# EAGLE design Group_02 (EAGLE 9.6.2)
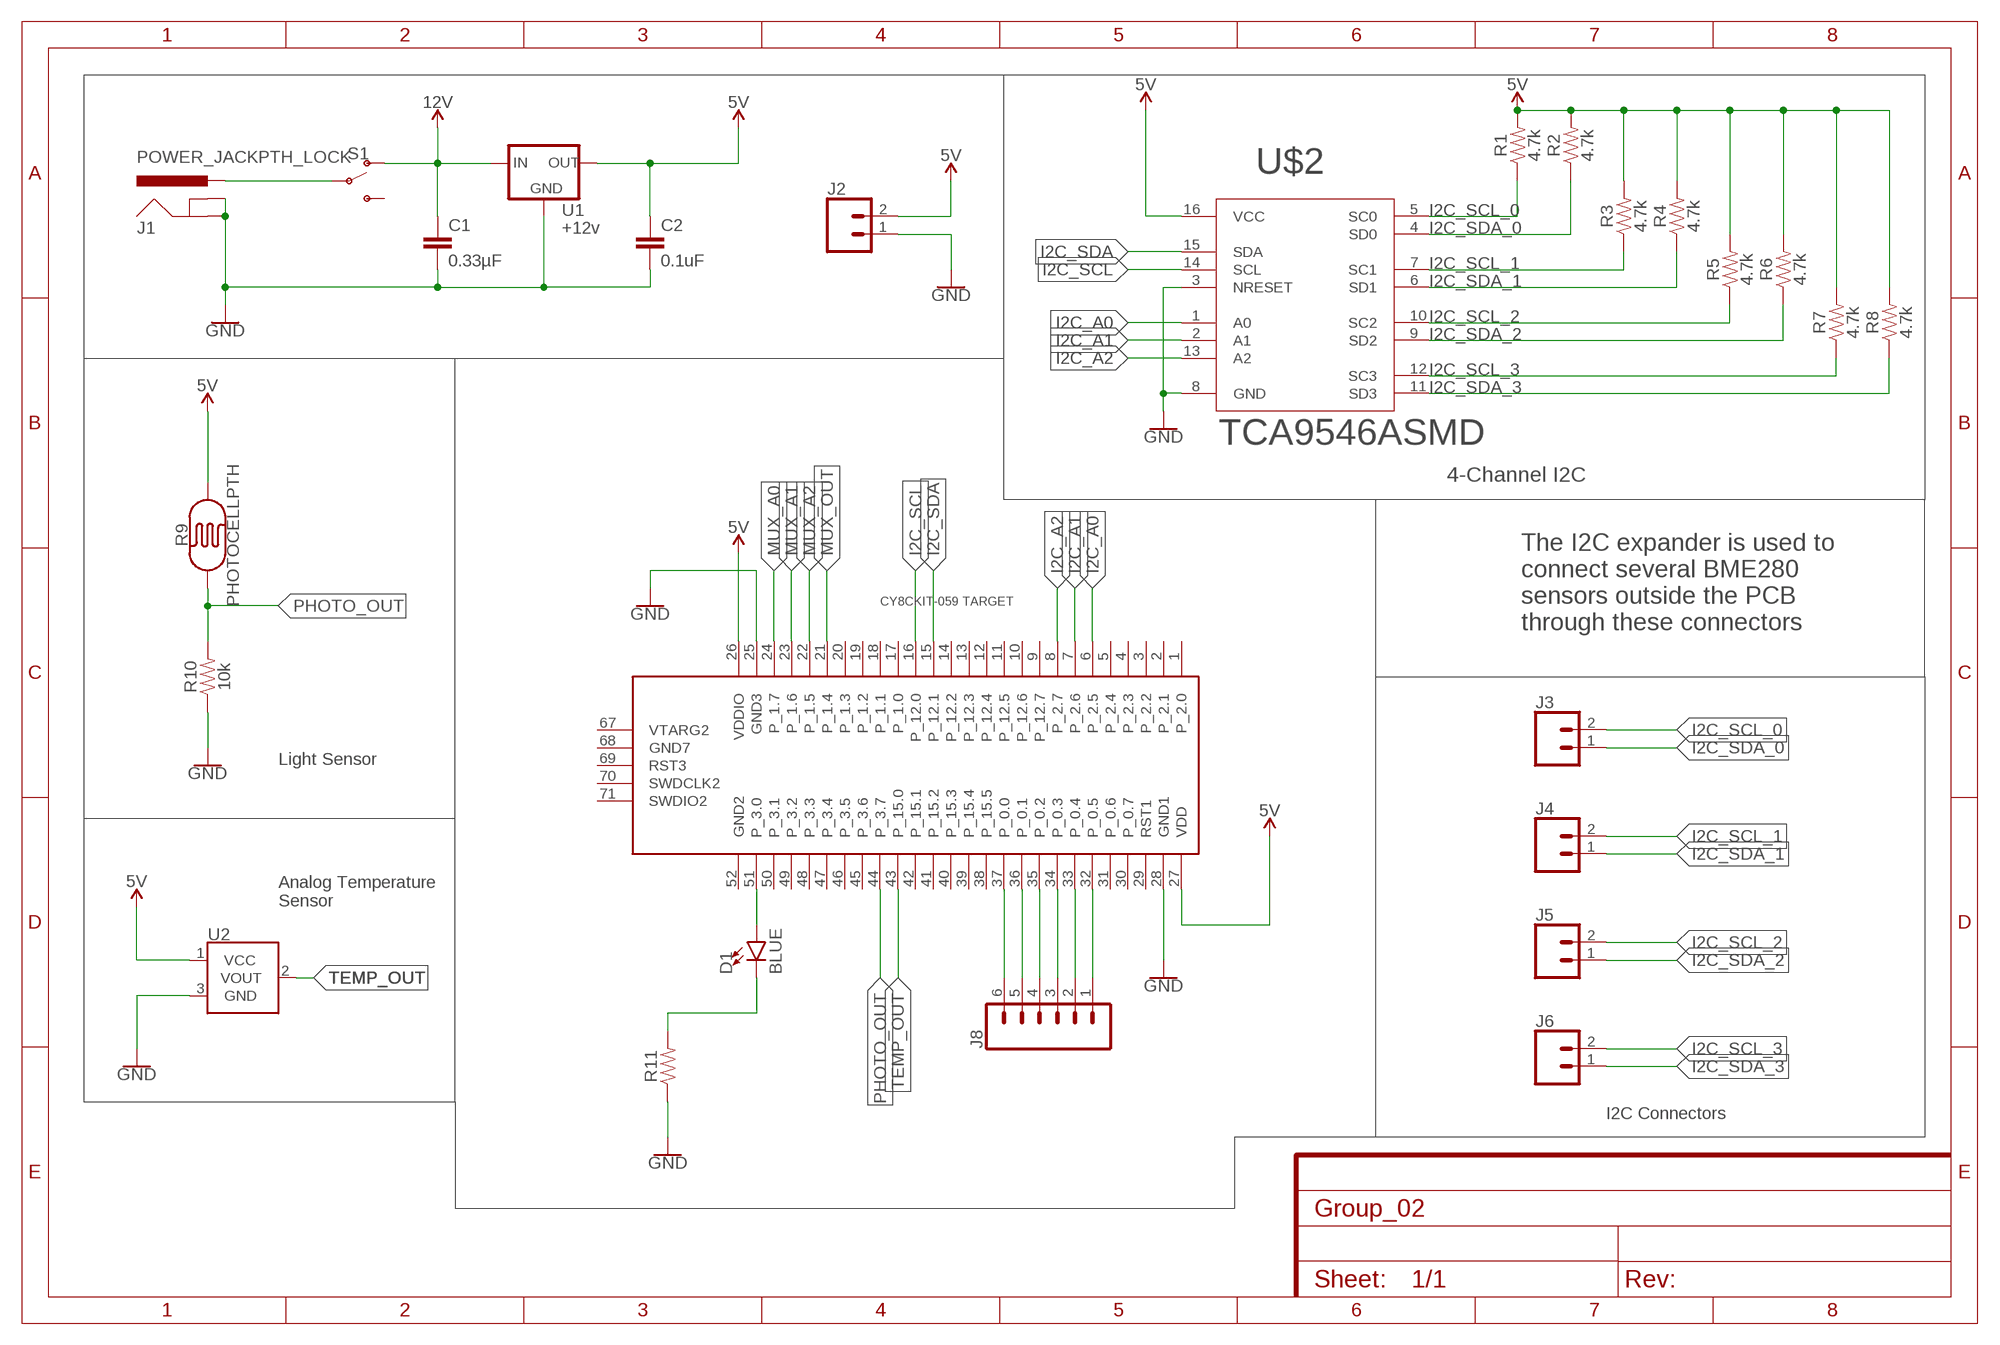
[diagram p0: schematic, sheet 1, part 1 of 2]
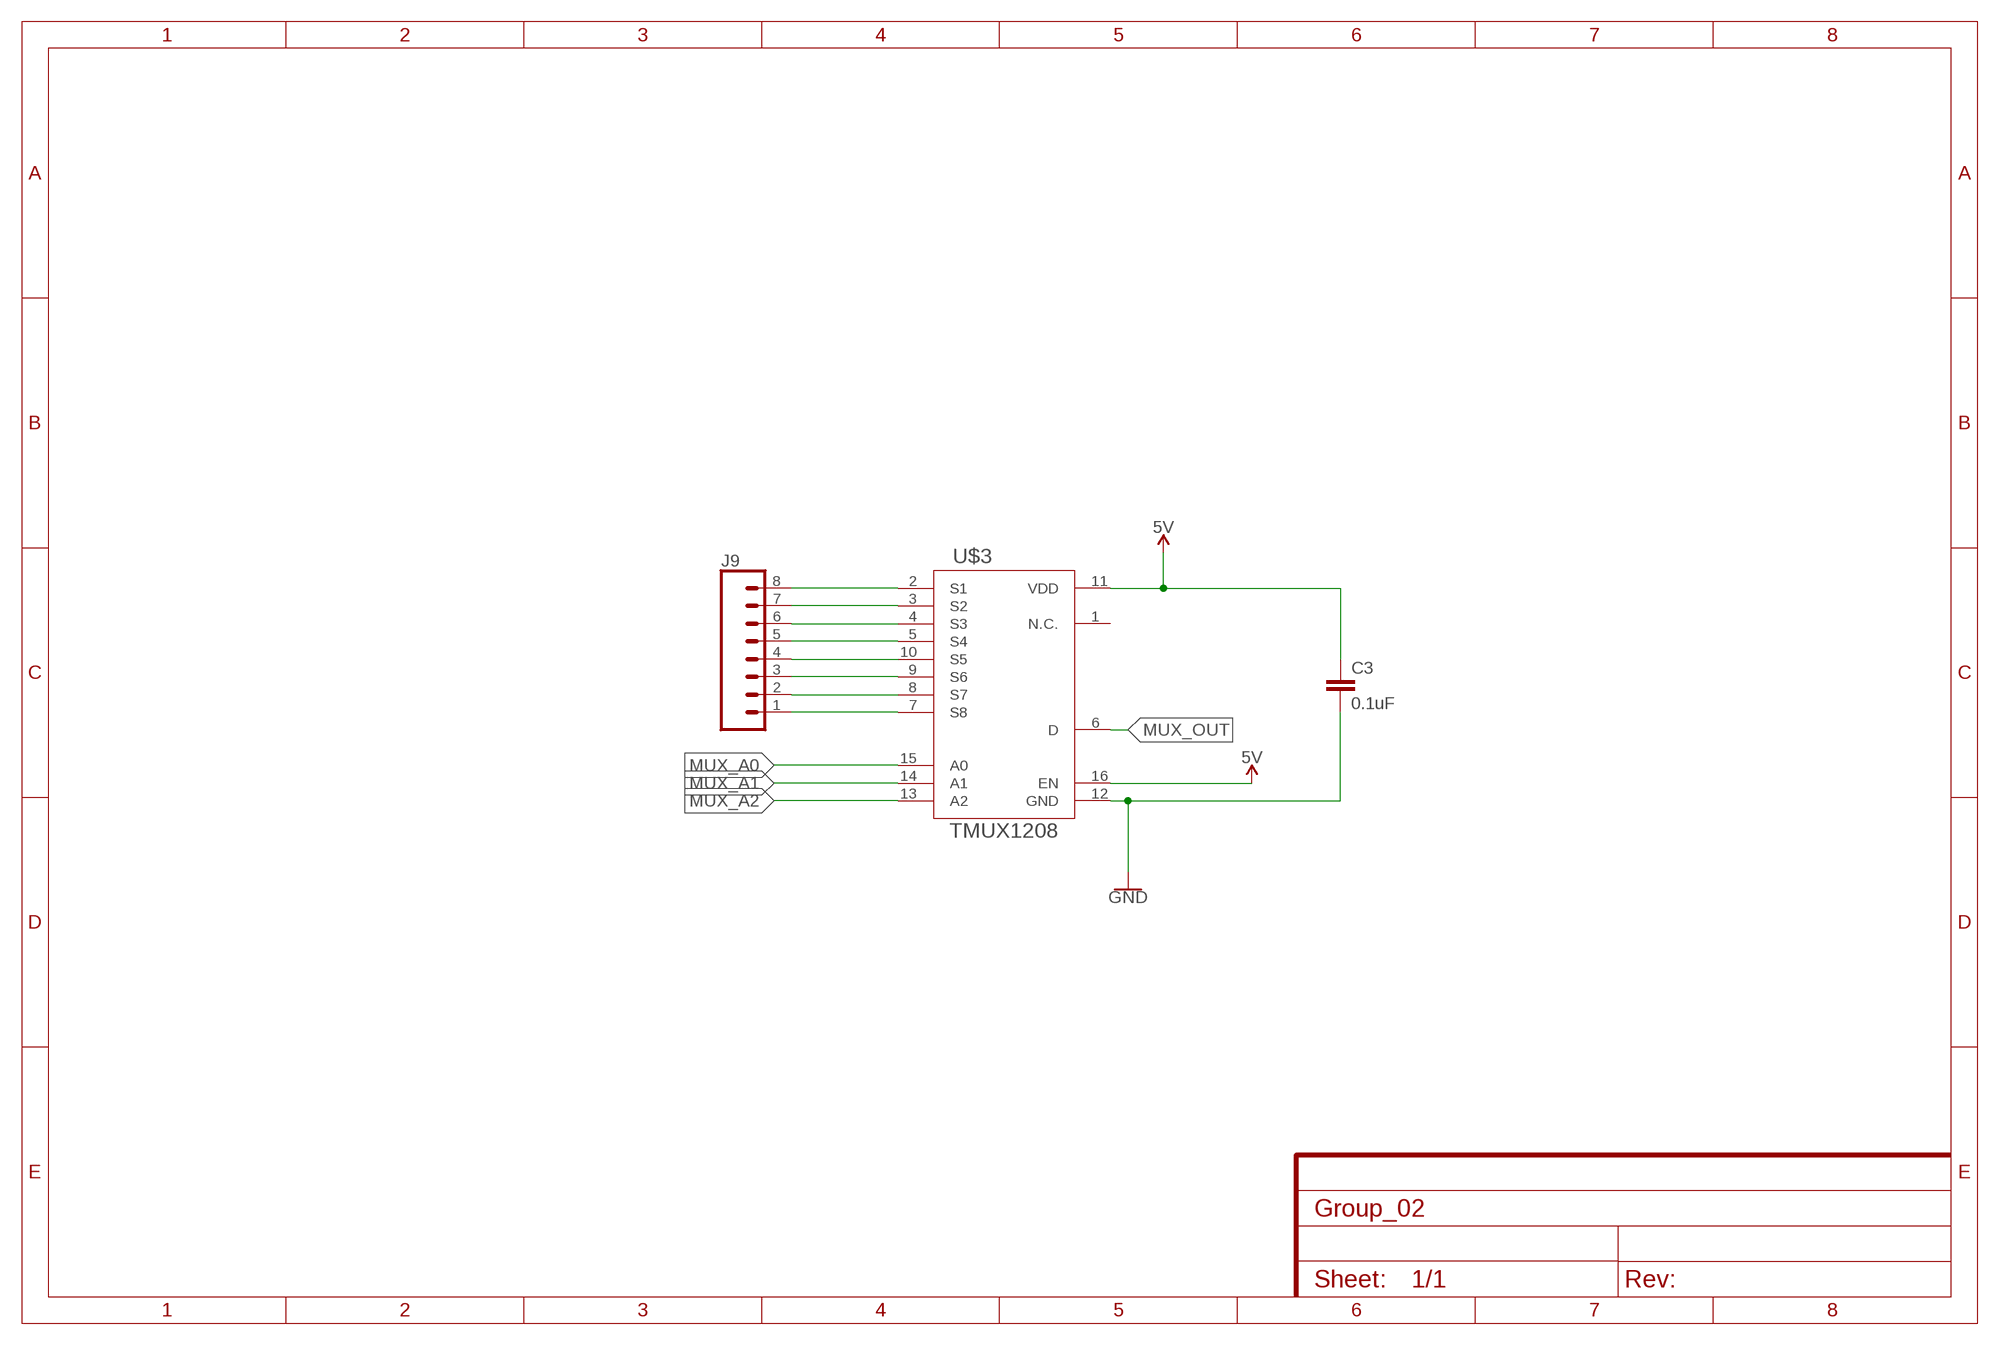
[diagram p1: schematic, sheet 1, part 2 of 2]

## Parts
C1  0.33µF  0.33UF/330NF-0805-50V-10%  [0805]
C2  0.1uF  0.1UF-KIT-EZ-50V-20%  [CAP-PTH-SMALL-KIT]
C3  0.1uF  0.1UF-KIT-EZ-50V-20%  [CAP-PTH-SMALL-KIT]
D1  BLUE  LED-BLUE1206  [LED-1206]
J1  POWER_JACKPTH_LOCK  [POWER_JACK_PTH_LOCK]
J2  CONN_02  [1X02]
J3  CONN_02  [1X02]
J4  CONN_02  [1X02]
J5  CONN_02  [1X02]
J6  CONN_02  [1X02]
J8  CONN_06LOCK  [1X06_LOCK]
J9  CONN_08LOCK  [1X08_LOCK]
R1  4.7k  4.7KOHM-0603-1/10W-1%  [0603]
R2  4.7k  4.7KOHM-0603-1/10W-1%  [0603]
R3  4.7k  4.7KOHM-0603-1/10W-1%  [0603]
R4  4.7k  4.7KOHM-0603-1/10W-1%  [0603]
R5  4.7k  4.7KOHM-0603-1/10W-1%  [0603]
R6  4.7k  4.7KOHM-0603-1/10W-1%  [0603]
R7  4.7k  4.7KOHM-0603-1/10W-1%  [0603]
R8  4.7k  4.7KOHM-0603-1/10W-1%  [0603]
R9  PHOTOCELLPTH  [PHOTOCELL]
R10  10k  10KOHM-0603-1/10W-1%  [0603]
R11  RESISTORAXIAL-0.3  [AXIAL-0.3]
S1  SWITCH-SPDT-PTH-11.6X4.0MM  [SWITCH_SPDT_PTH_11.6X4.0MM]
U1  +12v  V_REG_78XX7812  [TO-252]
U2  TMP36GT9  [TO-92]
U$1  CY8CKIT-059_TARGET  [CY8CKIT-059_TARGET]
U$2  TCA9546ASMD  [TSSOP-16]
U$3  TMUX1208  [QFN-16]

## Nets
5V: C2.1 C3.1 J2.2 R1.2 R2.2 R3.2 R4.2 R5.2 R6.2 R7.2 R8.2 R9.2 U1.2(OUT) U2.1(VCC) U$1.26(VDDIO) U$1.27(VDD) U$2.16(VCC) U$3.11(VDD) U$3.16(EN)
12V: C1.1 S1.1(O) U1.1(IN)
GND: C1.2 C2.2 C3.2 J1.GND J1.GNDBREAK J2.1 R10.1 R11.P$1 U1.3(GND) U2.3(GND) U$1.25(GND3) U$1.28(GND1) U$2.3(NRESET) U$2.8(GND) U$3.12(GND)
I2C_A0: U$1.6(P_2.5) U$2.1(A0)
I2C_A1: U$1.7(P_2.6) U$2.2(A1)
I2C_A2: U$1.8(P_2.7) U$2.13(A2)
I2C_SCL: U$1.16(P_12.0) U$2.14(SCL)
I2C_SCL_0: J3.2 R1.1 U$2.5(SC0)
I2C_SCL_1: J4.2 R3.1 U$2.7(SC1)
I2C_SCL_2: J5.2 R5.1 U$2.10(SC2)
I2C_SCL_3: J6.2 R7.1 U$2.12(SC3)
I2C_SDA: U$1.15(P_12.1) U$2.15(SDA)
I2C_SDA_0: J3.1 R2.1 U$2.4(SD0)
I2C_SDA_1: J4.1 R4.1 U$2.6(SD1)
I2C_SDA_2: J5.1 R6.1 U$2.9(SD2)
I2C_SDA_3: J6.1 R8.1 U$2.11(SD3)
MUX_A0: U$1.24(P_1.7) U$3.15(A0)
MUX_A1: U$1.23(P_1.6) U$3.14(A1)
MUX_A2: U$1.22(P_1.5) U$3.13(A2)
MUX_OUT: U$1.21(P_1.4) U$3.6(D)
N$1: J1.PWR S1.2(P)
N$2: J8.1 U$1.32(P_0.5)
N$3: J8.2 U$1.33(P_0.4)
N$4: J8.3 U$1.34(P_0.3)
N$5: J8.4 U$1.35(P_0.2)
N$6: J8.5 U$1.36(P_0.1)
N$7: J8.6 U$1.37(P_0.0)
N$8: D1.A U$1.51(P_3.0)
N$9: D1.C R11.P$2
N$10: J9.8 U$3.2(S1)
N$11: J9.7 U$3.3(S2)
N$12: J9.6 U$3.4(S3)
N$13: J9.5 U$3.5(S4)
N$14: J9.4 U$3.10(S5)
N$15: J9.3 U$3.9(S6)
N$16: J9.2 U$3.8(S7)
N$17: J9.1 U$3.7(S8)
PHOTO_OUT: R9.1 R10.2 U$1.44(P_3.7)
TEMP_OUT [New Class]: U2.2(VOUT) U$1.43(P_15.0)
Unconnected: S1.3(S) U$1.1(P_2.0) U$1.2(P_2.1) U$1.3(P_2.2) U$1.4(P_2.3) U$1.5(P_2.4) U$1.9(P_12.7) U$1.10(P_12.6) U$1.11(P_12.5) U$1.12(P_12.4) U$1.13(P_12.3) U$1.14(P_12.2) U$1.17(P_1.0) U$1.18(P_1.1) U$1.19(P_1.2) U$1.20(P_1.3) U$1.29(RST1) U$1.30(P_0.7) U$1.31(P_0.6) U$1.38(P_15.5) U$1.39(P_15.4) U$1.40(P_15.3) U$1.41(P_15.2) U$1.42(P_15.1) U$1.45(P_3.6) U$1.46(P_3.5) U$1.47(P_3.4) U$1.48(P_3.3) U$1.49(P_3.2) U$1.50(P_3.1) U$1.52(GND2) U$1.67(VTARG2) U$1.68(GND7) U$1.69(RST3) U$1.70(SWDCLK2) U$1.71(SWDIO2) U$3.1(N.C.)

## Notes on the sheet
- 4-Channel I2C
- The I2C expander is used to
  connect several BME280 
  sensors outside the PCB 
  through these connectors
- Light Sensor
- Analog Temperature
  Sensor
- I2C Connectors

## Library data of the parts
C1 = SparkFun-Capacitors:0.33UF/330NF: 0.33µF/330nF ceramic capacitors A capacitor is a passive two-terminal electrical component used to store electrical energy temporarily in an electric field.; PROD_ID: CAP-08469
C2 C3 = SparkFun-Capacitors:0.1UF: 0.1µF ceramic capacitors A capacitor is a passive two-terminal electrical component used to store electrical energy temporarily in an electric field.; PROD_ID: CAP-08370
D1 = SparkFun-LED:LED-BLUE: Blue SMD LED Used in manufacturing of various products at SparkFun Packages: 0603 - SMD 0603 package [Product Link] <http://www.digikey.com/product-detail/en/SMLE12BC7TT86/511-1589-2-ND/1641808> 1206 - SMD1206 package [Product Link] <http://www.digikey.com/product-detail/en/lite-on-inc/LTST-C150TBKT/160-1643-1-ND/573584> SparkFun Products: ESP8266 Thing-Dev Board <https://www.sparkfun.com/products/13711> RedBoard <https://www.sparkfun.com/products/12757>; PROD_ID: DIO-09911
J1 = SparkFun-Connectors:POWER_JACK: Power Jack Connector This is the standard 5.5mm barrel jack for power. The PTH is the most common, proven, reliable, footprint. The Slot footprint only works if the mill layer is transmitted to the PCB fab house so be warned. Here are the connectors we sell at SparkFun: DC Barrel Power Jack/Connector <https://www.sparkfun.com/products/119> (PRT-00119) DC Barrel Power Jack/Connector (SMD) <https://www.sparkfun.com/products/12748> (PRT-12748) DC Barrel Jack Adapter - Breadboard Compatible <https://www.sparkfun.com/products/10811> (PRT-10811) It is used on this SparkFun product (and many, many others): SparkFun RedBoard - Programmed with Arduino <https://www.sparkfun.com/products/12757> (DEV-12757) Also, if you need a mating power supply or connector, please check these out: Wall Adapter Power Supply - 9VDC 650mA <https://www.sparkfun.com/products/298> (TOL-00298) DC Barrel Jack Adapter - Male <https://www.sparkfun.com/products/10287> (PRT-10287); PROD_ID: CONN-08197; SF_ID: PRT-00119
J2-J6 = SparkFun-Connectors:CONN_02: Multi connection point. Often used as Generic Header-pin footprint for 0.1 inch spaced/style header connections On any of the 0.1 inch spaced packages, you can populate with these: Break Away Headers - Straight <https://www.sparkfun.com/products/116> (PRT-00116) Break Away Male Headers - Right Angle <https://www.sparkfun.com/products/553> (PRT-00553) Female Headers <https://www.sparkfun.com/products/115> (PRT-00115) Break Away Headers - Machine Pin <https://www.sparkfun.com/products/117> (PRT-00117) Break Away Female Headers - Swiss Machine Pin <https://www.sparkfun.com/products/743> (PRT-00743) For SCREWTERMINALS and SPRING TERMINALS visit here: Screw Terimnals on SparkFun.com <https://www.sparkfun.com/search/results?term=Screw+Terminals> (5mm/3.5mm/2.54mm spacing) This device is also useful as a general connection point to wire up your design to another part of your project. Our various solder wires solder well into these plated through hole pads. Hook-Up Wire - Assortment (Stranded, 22 AWG) <https://www.sparkfun.com/products/11375> (PRT-11375) Hook-Up Wire - Assortment (Solid Core, 22 AWG) <https://www.sparkfun.com/products/11367> (PRT-11367) View the entire wire category on our website here <https://www.sparkfun.com/categories/141> Special notes: Molex polarized connector foot print use with: PRT-08233 with associated crimp pins and housings. 2.54_SCREWTERM for use with PRT-10571. 3.5mm Screw Terminal footprints for PRT-08084 5mm Screw Terminal footprints for use with PRT-08432
J8 = SparkFun-Connectors:CONN_06: Multi connection point. Often used as Generic Header-pin footprint for 0.1 inch spaced/style header connections On any of the 0.1 inch spaced packages, you can populate with these: Break Away Headers - Straight <https://www.sparkfun.com/products/116> (PRT-00116) Break Away Male Headers - Right Angle <https://www.sparkfun.com/products/553> (PRT-00553) Female Headers <https://www.sparkfun.com/products/115> (PRT-00115) Break Away Headers - Machine Pin <https://www.sparkfun.com/products/117> (PRT-00117) Break Away Female Headers - Swiss Machine Pin <https://www.sparkfun.com/products/743> (PRT-00743) Arduino Stackable Header - 6 Pin <https://www.sparkfun.com/products/9280> (PRT-09280) For SCREWTERMINALS and SPRING TERMINALS visit here: Screw Terimnals on SparkFun.com <https://www.sparkfun.com/search/results?term=Screw+Terminals> (5mm/3.5mm/2.54mm spacing) This device is also useful as a general connection point to wire up your design to another part of your project. Our various solder wires solder well into these plated through hole pads. Hook-Up Wire - Assortment (Stranded, 22 AWG) <https://www.sparkfun.com/products/11375> (PRT-11375) Hook-Up Wire - Assortment (Solid Core, 22 AWG) <https://www.sparkfun.com/products/11367> (PRT-11367) View the entire wire category on our website here <https://www.sparkfun.com/categories/141>
J9 = SparkFun-Connectors:CONN_08: Multi connection point. Often used as Generic Header-pin footprint for 0.1 inch spaced/style header connections On any of the 0.1 inch spaced packages, you can populate with these: Break Away Headers - Straight <https://www.sparkfun.com/products/116> (PRT-00116) Break Away Male Headers - Right Angle <https://www.sparkfun.com/products/553> (PRT-00553) Female Headers <https://www.sparkfun.com/products/115> (PRT-00115) Break Away Headers - Machine Pin <https://www.sparkfun.com/products/117> (PRT-00117) Break Away Female Headers - Swiss Machine Pin <https://www.sparkfun.com/products/743> (PRT-00743) Arduino Stackable Header - 8 Pin <https://www.sparkfun.com/products/9279> (PRT-09279) For SCREWTERMINALS and SPRING TERMINALS visit here: Screw Terimnals on SparkFun.com <https://www.sparkfun.com/search/results?term=Screw+Terminals> (5mm/3.5mm/2.54mm spacing) This device is also useful as a general connection point to wire up your design to another part of your project. Our various solder wires solder well into these plated through hole pads. Hook-Up Wire - Assortment (Stranded, 22 AWG) <https://www.sparkfun.com/products/11375> (PRT-11375) Hook-Up Wire - Assortment (Solid Core, 22 AWG) <https://www.sparkfun.com/products/11367> (PRT-11367) View the entire wire category on our website here <https://www.sparkfun.com/categories/141> Special notes: Molex polarized connector foot print use with SKU : PRT-08231 with associated crimp pins and housings. 1MM SMD Version SKU: PRT-10208 NOTES ON THE VARIANTS LOCK and LOCK_LONGPADS... This footprint was designed to help hold the alignment of a through-hole component (i.e. 6-pin header) while soldering it into place. You may notice that each hole has been shifted either up or down by 0.005 of an inch from it's more standard position (which is a perfectly straight line). This slight alteration caused the pins (the squares in the middle) to touch the edges of the holes. Because they are alternating, it causes a "brace" to hold the component in place. 0.005 has proven to be the perfect amount of "off-center" position when using our standard breakaway headers. Although looks a little odd when you look at the bare footprint, once you have a header in there, the alteration is very hard to notice. Also,if you push a header all the way into place, it is covered up entirely on the bottom side.
R1-R8 = SparkFun-Resistors:4.7KOHM: 4.7kΩ resistor A resistor is a passive two-terminal electrical component that implements electrical resistance as a circuit element. Resistors act to reduce current flow, and, at the same time, act to lower voltage levels within circuits. - Wikipedia; PROD_ID: RES-07857
R9 = SparkFun-Sensors:PHOTOCELL: Photocell (Photodetector, Photo Resistor, CdS) This is a very small light sensor. A photocell changes (also called a photodetector, photo resistor, CdS or photoconductive cell) resistance depending on the amount of light it is exposed to. These little sensors make great ambient light triggers (when light in the room turns on, do something). Datasheet <http://cdn.sparkfun.com/datasheets/Sensors/LightImaging/SEN-09088.pdf> SparkFun Products Mini Photocell <https://www.sparkfun.com/products/9088> (SEN-09088); PROD_ID: COMP-09129; SF_ID: SEN-09088
R10 = SparkFun-Resistors:10KOHM: 10kΩ resistor A resistor is a passive two-terminal electrical component that implements electrical resistance as a circuit element. Resistors act to reduce current flow, and, at the same time, act to lower voltage levels within circuits. - Wikipedia; PROD_ID: RES-00824
R11 = SparkFun-Resistors:RESISTOR: Generic Resistor Package
S1 = SparkFun-Switches:SWITCH-SPDT: Single Pole, Double Throw (SPDT) Switch Single-pole, double-throw (SPDT) switch. Variant Overview SMD-AYZ0202 Surface Mount DPDT Switch <https://www.sparkfun.com/products/597> (COM-00597) Used on e.g. LilyPad Arduino USB - ATmega32U4 Board <https://www.sparkfun.com/products/12049> PTH-11.6X4.0MM SPDT Mini Power Switch <https://www.sparkfun.com/products/102> (COM-00102) Used on e.g. SparkFun Simon Says - Through-Hole Soldering Kit <https://www.sparkfun.com/products/10547> (KIT-10547) PTH-11.6X4.0MM-KIT KIT version of SPDT Mini Power Switch - Simplifies soldering by removing tStop of switch pins - only one side can be soldered. PTH-11.6X4.0MM-LOCK LOCK version of SPDT Mini Power Switch - Offset pins hold switch in place for easier soldering. SMD-RIGHT-ANGLE Surface Mount Right Angle Switch <https://www.sparkfun.com/products/10860> (COM-10860) Used on e.g. SparkFun ESP8266 Thing <https://www.sparkfun.com/products/13231>; PROD_ID: SWCH-08261; SF_SKU: COM-00102
U1 = SparkFun-IC-Power:V_REG_78XX: Voltage Regulator Standard 78xx regulator. IGO (Input Ground Output). Spark Fun Electronics SKU : COM-00107; PROD_ID: VREG-12370
U2 = SparkFun-Sensors:TMP36: TMP36 Precision Analog °C Temperature Sensor The TMP36 is a low voltage, precision centigrade temperature sensor. It provides a voltage output that is linearly proportional to the Celsius temperature. It also doesn’t require any external calibration to provide typical accuracies of ±1°C at +25°C and ±2°C over the −40°C to +125°C temperature range. We like it because it’s so easy to use: Just give the device a ground and 2.7 to 5.5 VDC and read the voltage on the Vout pin. The output voltage can be converted to temperature easily using the scale factor of 10 mV/°C. Datasheet <http://cdn.sparkfun.com/datasheets/Sensors/Temp/TMP35_36_37.pdf> SparkFun Products Temperature Sensor - TMP36 <https://www.sparkfun.com/products/10988> (SEN-10988) SparkFun Danger Shield <https://www.sparkfun.com/products/11649> (DEV-11649); PROD_ID: IC-09880; SF_ID: SEN-10988
U$1 = CY8KIT-059:CY8CKIT-059_TARGET: CY8CKIT-059 Target This device exposes the pins of the target section of the CY8CKIT-059, including the programming section, that must be connected to the KitProg in order to program the target micro-controller.
U$2 = Group_02_Library:TCA9546A: TCA9546A The TCA9546A is a quad bidirectional translating switch controlled via the I^2C bus. The SCL/SDA upstream pair fans out to four downstream pairs, or channels. Any individual SCn/SDn channel or combination of channels can be selected, determined by the contents of the programmable control register. Available packages: TSSOP-16 SOIC-16
U$3 = Group_02_Library:TMUX1208: TMUX1208 The TMUX1208 and TMUX1209 are general purpose complementary metal-oxide semiconductor (CMOS) multiplexers (MUX). The TMUX1208 offers 8:1 singleended channels, while the TMUX1209 offers differential 4:1 or dual 4:1 single-ended channels. Wide operating supply of 1.08 V to 5.5 V allows for use in a broad array of applications from personal electronics to building automation applications. The device supports bidirectional analog and digital signals on the source (Sx) and drain (D) pins ranging from GND to VDD. Available packages: TSSOP-16 QFN-16

## Board
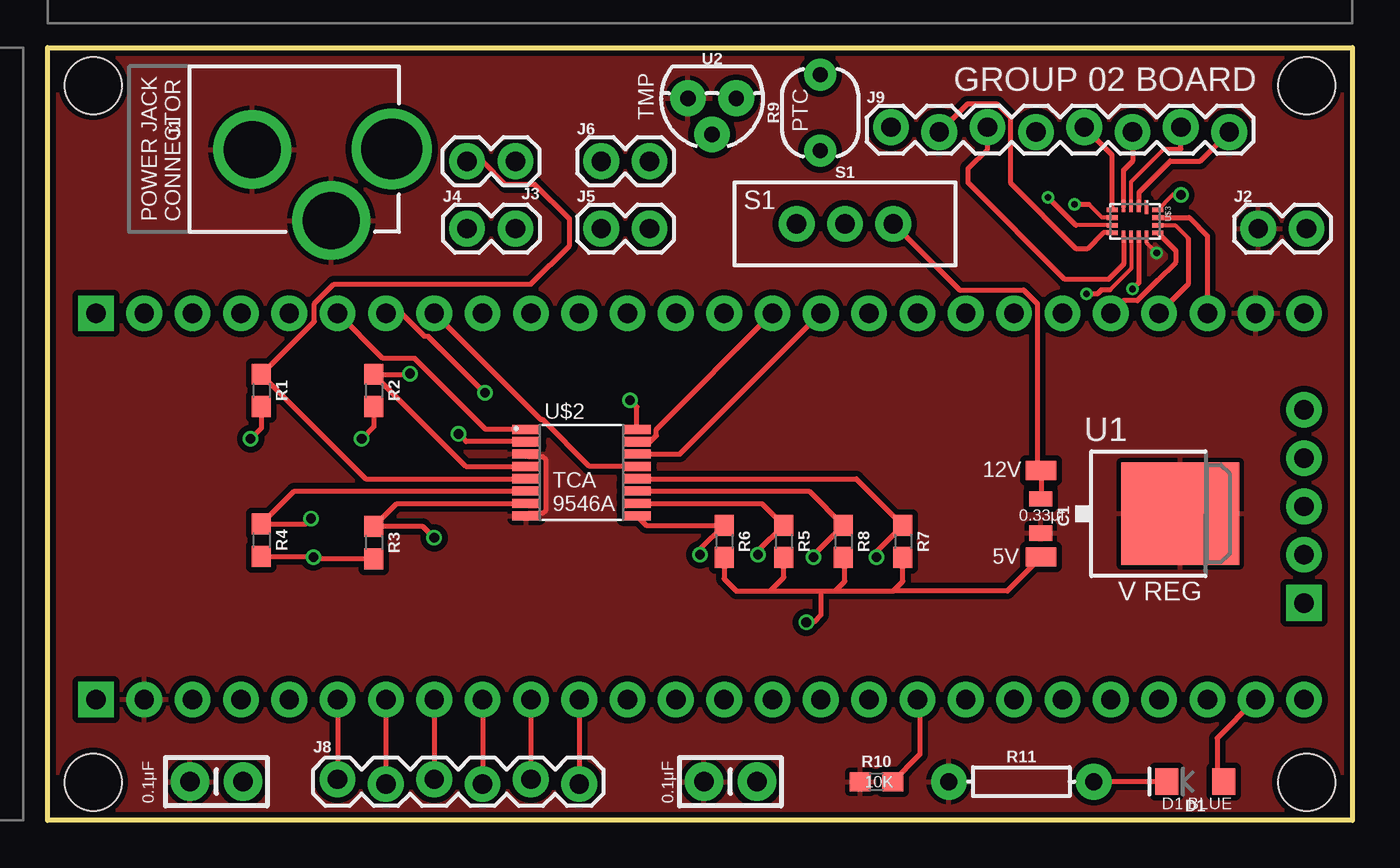
[diagram p2: board, top side]
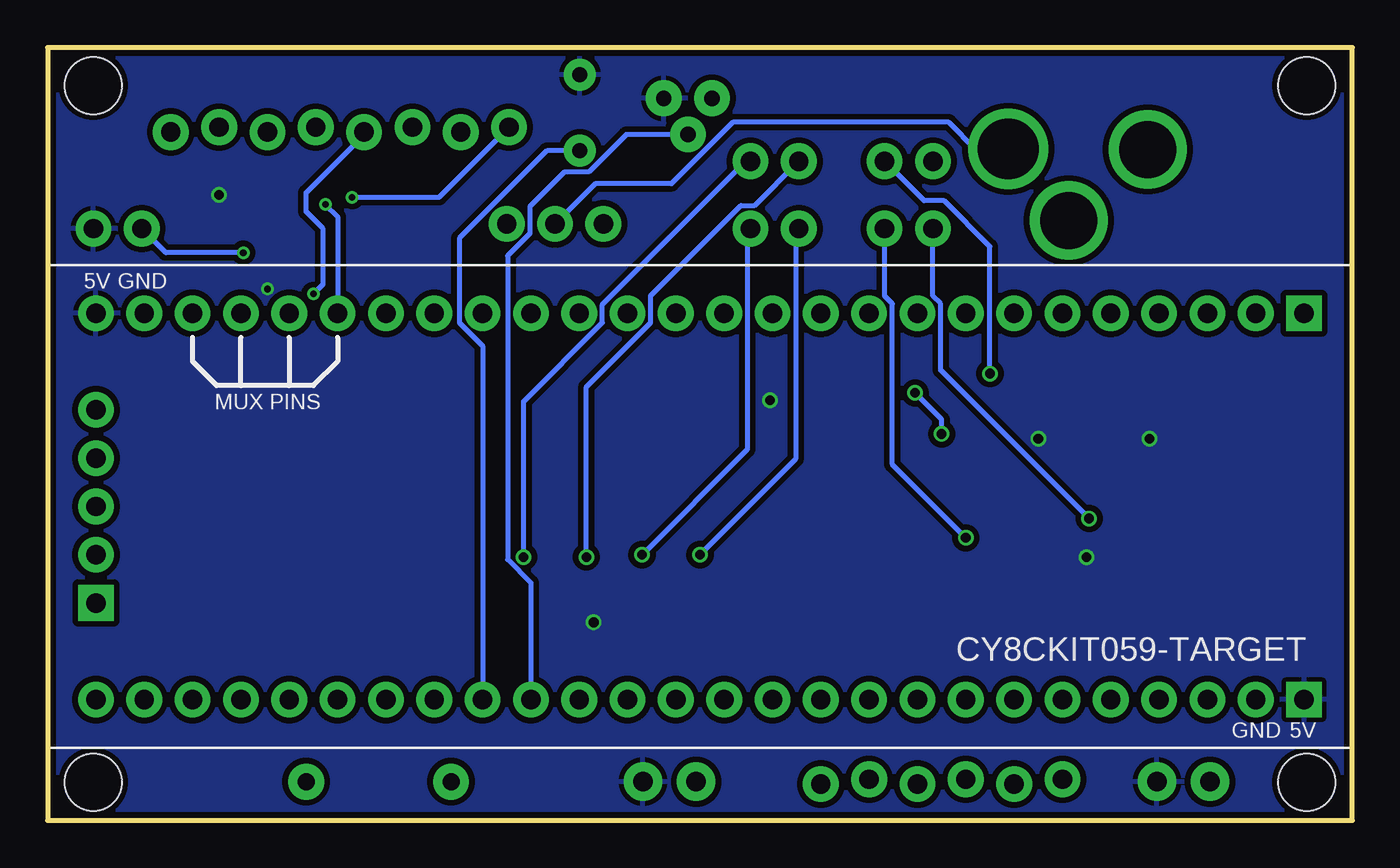
[diagram p3: board, bottom side, seen from below]

Size 68.58 x 40.64 mm. Coordinates in mm from the lower left corner, seen from the top.
Outline: 0,0 0,40.64 68.58,40.64 68.58,0 0,0
Copper layers (1*16): Top 0.035mm / dielectric 1.5mm / Bottom 0.035mm
Design rules "Group_02": minimum track width 6mil, minimum drill 8mil, track to track 6mil, track to pad 6mil, pad to pad 6mil, via to via 6mil, smd to smd 6mil, copper to edge 8mil, drill to drill 22mil, minimum pad ring 8mil, minimum via ring 6mil, stop-mask expansion 8mil, vias tented up to drill 0mil, thermal gap 10mil
Holes 3 mm at 2.4,2 66.18,2 66.18,38.64 2.4,38.64

### Footprints (pad centres in the part's own frame; a part is rotated, then mirrored left to right if it is on the bottom)
0805 = smd 0.8 x 1.2: 1 -0.9,0; 2 0.9,0
CAP-PTH-SMALL-KIT = drill 1.016 pad 2.032: 1 -1.397,0; 2 1.397,0
LED-1206 = smd 1.2 x 1.4: A -1.5,0; C 1.5,0
POWER_JACK_PTH_LOCK = drill 2.997 pad 4.115: GND 0.025,6.557; GNDBREAK 3.762,10.7 | drill 3.2 pad 4.115: PWR 0,13.878
1X02 = drill 1.016 pad 1.88: 1 0,0; 2 2.54,0
1X06_LOCK = drill 1.016 pad 1.88: 1 0,0; 2 2.54,-0.254; 3 5.08,0; 4 7.62,-0.254; 5 10.16,0; 6 12.7,-0.254
1X08_LOCK = drill 1.016 pad 1.88: 1 0,0.127; 2 2.54,-0.127; 3 5.08,0.127; 4 7.62,-0.127; 5 10.16,0.127; 6 12.7,-0.127; 7 15.24,0.127; 8 17.78,-0.127
0603 = smd 1.1 x 1: 1 -0.85,0; 2 0.85,0
PHOTOCELL = drill 0.8 pad 1.676: 1 -2,0; 2 2,0
AXIAL-0.3 = drill 0.9 pad 1.88: P$1 -3.81,0; P$2 3.81,0
SWITCH_SPDT_PTH_11.6X4.0MM = drill 1.016 pad 1.88: 1 0,2.54; 2 0,0; 3 0,-2.54
TO-252 = smd 1 x 1.6: 1 -2.28,-4.8; 2 2.28,-4.8 | smd 5.4 x 6.2: 3 0,2.5
TO-92 = drill 0.813 pad 1.88: 1 -1.27,0; 2 0,1.905; 3 1.27,0
CY8CKIT-059_TARGET = drill 1.016 pad 1.876 square: 1 30.48,8.89; 27 30.48,-11.43; 71 -33.02,-6.35 | drill 1.016 pad 1.876: 2 27.94,8.89; 3 25.4,8.89; 4 22.86,8.89; 5 20.32,8.89; 6 17.78,8.89; 7 15.24,8.89; 8 12.7,8.89; 9 10.16,8.89; 10 7.62,8.89; 11 5.08,8.89; 12 2.54,8.89; 13 0,8.89; 14 -2.54,8.89; 15 -5.08,8.89; 16 -7.62,8.89; 17 -10.16,8.89; 18 -12.7,8.89; 19 -15.24,8.89; 20 -17.78,8.89; 21 -20.32,8.89; 22 -22.86,8.89; 23 -25.4,8.89; 24 -27.94,8.89; 25 -30.48,8.89; 26 -33.02,8.89; 28 27.94,-11.43; 29 25.4,-11.43; 30 22.86,-11.43; 31 20.32,-11.43; 32 17.78,-11.43; 33 15.24,-11.43; 34 12.7,-11.43; 35 10.16,-11.43; 36 7.62,-11.43; 37 5.08,-11.43; 38 2.54,-11.43; 39 0,-11.43; 40 -2.54,-11.43; 41 -5.08,-11.43; 42 -7.62,-11.43; 43 -10.16,-11.43; 44 -12.7,-11.43; 45 -15.24,-11.43; 46 -17.78,-11.43; 47 -20.32,-11.43; 48 -22.86,-11.43; 49 -25.4,-11.43; 50 -27.94,-11.43; 51 -30.48,-11.43; 52 -33.02,-11.43; 67 -33.02,3.81; 68 -33.02,1.27; 69 -33.02,-1.27; 70 -33.02,-3.81
TSSOP-16 = smd 1.5 x 0.45: 1 -2.9,2.275; 2 -2.9,1.625; 3 -2.9,0.975; 4 -2.9,0.325; 5 -2.9,-0.325; 6 -2.9,-0.975; 7 -2.9,-1.625; 8 -2.9,-2.275; 9 2.9,-2.275; 10 2.9,-1.625; 11 2.9,-0.975; 12 2.9,-0.325; 13 2.9,0.325; 14 2.9,0.975; 15 2.9,1.625; 16 2.9,2.275
QFN-16 = smd 0.7 x 0.2: 1 -0.75,0.6 | smd 0.6 x 0.2: 2 -0.8,0.2; 3 -0.8,-0.2; 4 -0.8,-0.6; 9 0.8,-0.6; 10 0.8,-0.2; 11 0.8,0.2; 12 0.8,0.6 | smd 0.2 x 0.6: 5 -0.6,-1.2; 6 -0.2,-1.2; 7 0.2,-1.2; 8 0.6,-1.2; 13 0.6,1.2; 14 0.2,1.2; 15 -0.2,1.2; 16 -0.6,1.2

### Placement (x,y rotation side)
C1  52.2,16 270 top
C2  35.89,2.03 180 top
C3  8.88,2.03 180 top
D1  60.33,2.03 180 top
J1  4.21,35.31 270 top
J2  63.63,31.11 0 top
J3  24.59,34.66 180 top
J4  22.05,31.11 0 top
J5  29.1,31.11 0 top
J6  29.1,34.66 0 top
J8  15.24,2.16 0 top
J9  44.32,36.32 0 top
R1  11.24,22.61 270 top
R2  17.15,22.61 270 top
R3  17.15,14.61 270 top
R4  11.24,14.73 270 top
R5  38.69,14.67 270 top
R6  35.56,14.67 270 top
R7  44.96,14.67 270 top
R8  41.83,14.67 270 top
R9  40.61,37.21 90 top
R10  43.56,2.03 0 top
R11  51.18,2.03 0 top
S1  41.91,31.37 270 top
U1  57.02,16.13 270 top
U2  34.92,37.97 180 top
U$1  33.02,17.78 0 bottom
U$2  28.07,18.29 0 top
U$3  57.15,31.5 270 top

### Tracks (layer width: path | path; a pad name or v marks a point on that pad's centre or on a via)
5V  (via drill 0.35, 0.51)
  Top 0.203: U$3.16 59.15,32.89
  Top 0.254: 59.15,32.89 v59.56,32.89 | R6.2 35.56,12.7 36.2,12.06 37.97,12.06 | R5.2 38.69,12.79 37.97,12.06 | 37.97,12.06 40.64,12.06 | 40.64,12.06 41.4,12.06 | 41.4,12.06 41.91,12.57 41.91,13.73 R8.2 | 41.4,12.06 44.45,12.06 | v39.88,10.41 40.26,10.41 40.64,10.79 40.64,12.06 | R4.2 13.93,13.88 v13.97,13.84 14.06,13.76 R3.2 | R1.2 11.24,20.64 v10.67,20.07 | R2.2 17.14,20.7 v16.51,20.07 | U$2.16 30.97,21.74 v30.61,22.1 | U1.2 50.44,12.06 44.45,12.06 | U$3.11 57.35,28.27 v57.02,27.94 | 44.45,12.06 44.96,12.57 R7.2
  pour Bottom (isolate 0.305): 0,0 0,40.64 68.58,40.64 68.58,0
12V
  Top 0.254: C1.1 52.22,16.93 U1.1 52.02,18.61 52.02,27.17 51.3,27.89 47.93,27.89 S1.1
GND  (via drill 0.35)
  Top 0.203: U$3.12 57.75,30.39 v58.29,29.84
  Top 0.254: U$2.8 25.31,16.16 26.03,16.16 26.2,16.33 26.2,18.95 26.03,19.12 25.31,19.12 U$2.3
  Bottom 0.254: v58.29,29.84 62.36,29.84 J2.1
  pour Top (isolate 0.305): 0,0 0,40.64 68.58,40.64 68.58,0
I2C_A0
  Top 0.254: U$1.6 17.62,24.29 19.3,24.29 23.02,20.56 U$2.1
I2C_A1  (via drill 0.51)
  Top 0.254: U$2.2 22,19.91 v21.59,20.32 | v22.99,22.48 20.01,25.45 19.82,25.45 18.6,26.67 U$1.7
  Bottom 0.254: v21.59,20.32 21.59,21.08 v22.99,22.48
I2C_A2
  Top 0.254: U$1.8 25.92,21.07 26.03,21.07 28.48,18.61 U$2.13
I2C_SCL
  Top 0.254: U$2.14 33.23,19.26 U$1.16
I2C_SCL_0
  Top 0.254: U$2.5 16.73,17.96 R1.1 14.02,26.24 14.02,27.17 15.04,28.19 25.4,28.19 27.43,30.23 27.43,31.62 25.62,33.44 24.08,33.44 22.86,34.66 J3.2
I2C_SCL_1  (via drill 0.51)
  Top 0.254: U$2.7 18.35,16.66 R3.1 19.72,15.46 v20.32,14.86
  Bottom 0.254: J4.2 24.59,27.58 24.18,27.17 24.18,18.72 v20.32,14.86
I2C_SCL_2  (via drill 0.51)
  Top 0.254: U$2.10 37.55,16.66 R5.1 37.34,14.16 v37.34,13.97
  Bottom 0.254: J5.2 31.8,30.95 31.8,19.5 v37.34,13.97
I2C_SCL_3  (via drill 0.51)
  Top 0.254: U$2.12 42.51,17.96 R7.1 43.56,14.12 v43.56,13.84
  Bottom 0.254: J6.2 31.89,34.66 39.42,27.12 39.42,26.17 43.56,22.03 v43.56,13.84
I2C_SDA
  Top 0.254: U$1.15 32,20.57 32,20.23 31.68,19.91 U$2.15
I2C_SDA_0  (via drill 0.51)
  Top 0.254: U$2.4 21.99,18.61 R2.1 19.01,23.46 v19.05,23.5
  Bottom 0.254: J3.1 22.52,32.59 21.47,32.59 19.05,30.17 v19.05,23.5
I2C_SDA_1  (via drill 0.51)
  Top 0.254: U$2.6 12.97,17.31 R4.1 13.55,15.58 v13.84,15.88
  Bottom 0.254: J4.1 22.05,27.58 21.64,27.17 21.64,23.68 v13.84,15.88
I2C_SDA_2  (via drill 0.51)
  Top 0.254: U$2.9 31.46,15.52 R6.1 34.29,14.25 v34.29,13.97
  Bottom 0.254: J5.1 29.26,30.95 29.26,19 v34.29,13.97
I2C_SDA_3  (via drill 0.51)
  Top 0.254: U$2.11 40.03,17.31 R8.1 40.26,13.95 v40.26,13.84
  Bottom 0.254: J6.1 31.42,32.33 32.14,32.33 36.88,27.59 36.88,26.17 40.26,22.79 v40.26,13.84
MUX_A0
  Top 0.254: U$3.15 60,31.7 60.96,30.73 U$1.24
MUX_A1
  Top 0.203: U$3.14 59.26,31.3 59.94,30.61
  Top 0.254: 59.94,30.61 59.94,28.19 U$1.23
MUX_A2
  Top 0.254: U$1.22 56.54,27.33 57.27,27.33 58.15,28.21 58.35,28.41 59.31,29.37 59.31,29.94 U$3.13
MUX_OUT  (via drill 0.35)
  Top 0.203: U$3.6 55.43,31.7 54.74,32.38
  Top 0.254: 54.74,32.38 v53.98,32.38
  Bottom 0.254: v53.98,32.38 53.34,31.75 U$1.21
N$1
  Bottom 0.254: J1.PWR 19.81,35.31 21.21,36.7 32.57,36.7 35.79,33.48 39.8,33.48 S1.2
N$2
  Top 0.254: U$1.32 J8.1
N$3
  Top 0.254: U$1.33 J8.2
N$4
  Top 0.254: U$1.34 J8.3
N$5
  Top 0.254: U$1.35 J8.4
N$6
  Top 0.254: U$1.36 J8.5
N$7
  Top 0.254: U$1.37 J8.6
N$8
  Top 0.254: D1.A 61.47,2.39 61.47,4.32 U$1.51
N$9
  Top 0.254: D1.C R11.P$2
N$10
  Top 0.254: J9.8 60.58,34.67 59,34.67 57.35,33.02 U$3.2
N$11
  Top 0.203: U$3.3 56.95,33.58 58.67,35.31
  Top 0.254: 58.67,35.31 59.56,35.31 J9.7
N$12
  Top 0.254: U$3.4 56.55,34.2 57.02,34.67 J9.6
N$13
  Top 0.254: U$3.5 55.95,34.98 J9.5
N$14  (via drill 0.35)
  Top 0.203: U$3.10 56.95,29.01 55.83,27.89
  Top 0.254: 55.83,27.89 55.38,27.89 55.17,27.69 v54.61,27.69
  Bottom 0.254: v54.61,27.69 54.1,28.19 54.1,31.11 54.99,32 54.99,33.02 51.94,36.07 J9.4
N$15
  Top 0.254: U$3.9 56.55,29.25 55.75,28.45 53.47,28.45 48.39,33.53 48.39,34.29 49.4,35.31 J9.3
N$16
  Top 0.254: U$3.8 55.49,30.9 54.64,30.05 54.07,30.05 50.62,33.5 50.62,36.95 49.91,37.67 48.34,37.67 J9.2
N$17  (via drill 0.35)
  Top 0.203: U$3.7 54.05,31.3
  Top 0.254: 54.05,31.3 v52.58,32.77
  Bottom 0.254: v52.58,32.77 48.01,32.77 J9.1
PHOTO_OUT
  Top 0.254: R10.2 45.85,3.47 45.85,6.22 U$1.44
  Bottom 0.254: U$1.44 45.72,24.95 46.94,26.17 46.94,30.61 42.33,35.21 R9.1
TEMP_OUT
  Bottom 0.254: U$1.43 43.18,12.49 44.4,13.71 44.4,29.7 43.23,30.86 43.23,32.28 41.42,34.09 40.15,34.09 38.17,36.07 U2.2

### Text on the board
tPlace: GROUP 02 BOARD | TMP | PTC | S1 | POWER JACK / CONNECTOR | 12V | TCA / 9546A | 0.33μf | 5V | V REG | 10K | 0.1μF | 0.1μF | D1 BLUE
bPlace: GND | 5V | MUX PINS | CY8CKIT059-TARGET | 5V | GND